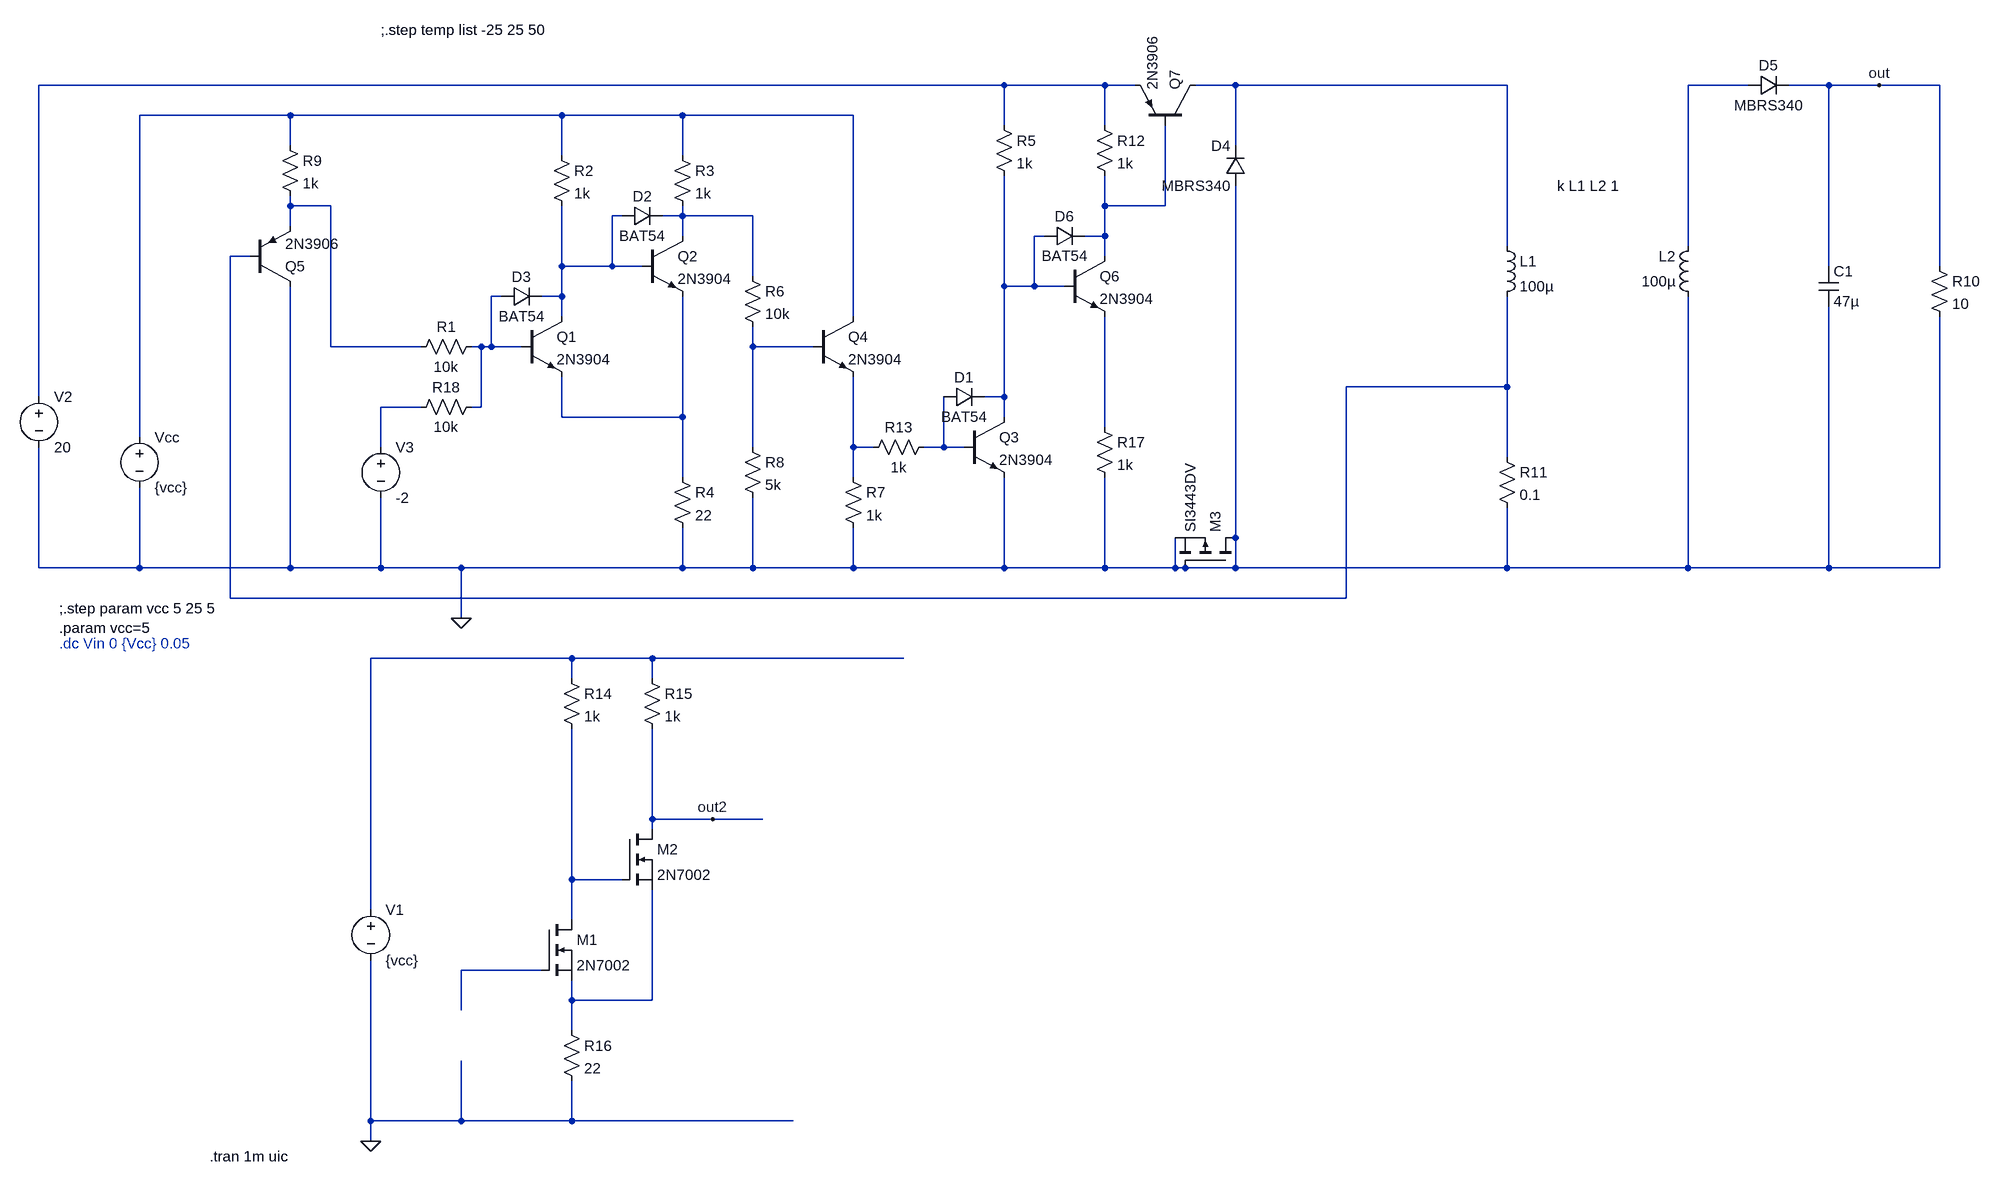
[diagram p0: schematic current_regulator2.asc]
current_regulator2.asc, the LTspice schematic file:
Version 4.1
SHEET 1 3940 3804
WIRE 912 -288 -624 -288
WIRE 1072 -288 912 -288
WIRE 1120 -288 1072 -288
WIRE 1280 -288 1216 -288
WIRE 1712 -288 1280 -288
WIRE 2096 -288 2000 -288
WIRE 2224 -288 2160 -288
WIRE 2304 -288 2224 -288
WIRE 2400 -288 2304 -288
WIRE -224 -240 -464 -240
WIRE 208 -240 -224 -240
WIRE 400 -240 208 -240
WIRE 672 -240 400 -240
WIRE 912 -224 912 -288
WIRE 1072 -224 1072 -288
WIRE -224 -192 -224 -240
WIRE 1280 -192 1280 -288
WIRE 208 -176 208 -240
WIRE 400 -176 400 -240
WIRE -224 -96 -224 -112
WIRE -160 -96 -224 -96
WIRE 1072 -96 1072 -144
WIRE 1168 -96 1168 -224
WIRE 1168 -96 1072 -96
WIRE 304 -80 288 -80
WIRE 400 -80 400 -96
WIRE 400 -80 368 -80
WIRE 512 -80 400 -80
WIRE -224 -64 -224 -96
WIRE 400 -48 400 -80
WIRE 976 -48 960 -48
WIRE 1072 -48 1072 -96
WIRE 1072 -48 1040 -48
WIRE 1712 -32 1712 -288
WIRE 2000 -32 2000 -288
WIRE -288 -16 -320 -16
WIRE 1072 -16 1072 -48
WIRE 208 0 208 -96
WIRE 288 0 288 -80
WIRE 288 0 208 0
WIRE 336 0 288 0
WIRE 2224 0 2224 -288
WIRE 2400 0 2400 -288
WIRE 512 16 512 -80
WIRE 912 32 912 -144
WIRE 960 32 960 -48
WIRE 960 32 912 32
WIRE 1008 32 960 32
WIRE 112 48 96 48
WIRE 208 48 208 0
WIRE 208 48 176 48
WIRE 208 80 208 48
WIRE 672 80 672 -240
WIRE -160 128 -160 -96
WIRE -16 128 -160 128
WIRE 80 128 64 128
WIRE 96 128 96 48
WIRE 96 128 80 128
WIRE 144 128 96 128
WIRE 512 128 512 96
WIRE 608 128 512 128
WIRE 1712 192 1712 48
WIRE 1712 192 1456 192
WIRE -624 208 -624 -288
WIRE 912 208 912 32
WIRE 912 208 880 208
WIRE -16 224 -80 224
WIRE 80 224 80 128
WIRE 80 224 64 224
WIRE 208 240 208 176
WIRE 400 240 400 48
WIRE 400 240 208 240
WIRE 912 240 912 208
WIRE 1072 256 1072 80
WIRE -464 272 -464 -240
WIRE -80 288 -80 224
WIRE 512 288 512 128
WIRE 672 288 672 176
WIRE 704 288 672 288
WIRE 816 288 816 208
WIRE 816 288 784 288
WIRE 848 288 816 288
WIRE 1712 304 1712 192
WIRE 400 336 400 240
WIRE 672 336 672 288
WIRE 1280 432 1280 -128
WIRE -624 480 -624 288
WIRE -464 480 -464 352
WIRE -464 480 -624 480
WIRE -224 480 -224 32
WIRE -224 480 -464 480
WIRE -80 480 -80 368
WIRE -80 480 -224 480
WIRE 48 480 -80 480
WIRE 400 480 400 416
WIRE 400 480 48 480
WIRE 512 480 512 368
WIRE 512 480 400 480
WIRE 672 480 672 416
WIRE 672 480 512 480
WIRE 912 480 912 336
WIRE 912 480 672 480
WIRE 1072 480 1072 336
WIRE 1072 480 912 480
WIRE 1184 480 1184 432
WIRE 1184 480 1072 480
WIRE 1200 480 1184 480
WIRE 1280 480 1280 432
WIRE 1280 480 1200 480
WIRE 1712 480 1712 384
WIRE 1712 480 1280 480
WIRE 2000 480 2000 48
WIRE 2000 480 1712 480
WIRE 2224 480 2224 64
WIRE 2224 480 2000 480
WIRE 2400 480 2400 80
WIRE 2400 480 2224 480
WIRE -320 528 -320 -16
WIRE 1456 528 1456 192
WIRE 1456 528 -320 528
WIRE 48 560 48 480
WIRE 224 624 -96 624
WIRE 352 624 224 624
WIRE 752 624 352 624
WIRE 224 656 224 624
WIRE 352 656 352 624
WIRE 352 880 352 736
WIRE 448 880 352 880
WIRE 528 880 448 880
WIRE 352 896 352 880
WIRE 224 976 224 736
WIRE 304 976 224 976
WIRE -96 1024 -96 624
WIRE 224 1040 224 976
WIRE 176 1120 48 1120
WIRE 224 1168 224 1136
WIRE 352 1168 352 992
WIRE 352 1168 224 1168
WIRE 48 1184 48 1120
WIRE 224 1216 224 1168
WIRE -96 1360 -96 1104
WIRE 48 1360 48 1264
WIRE 48 1360 -96 1360
WIRE 224 1360 224 1296
WIRE 224 1360 48 1360
WIRE 576 1360 224 1360
WIRE -96 1392 -96 1360
FLAG 48 560 0
FLAG -96 1392 0
FLAG 448 880 out2
FLAG 2304 -288 out
SYMBOL npn 144 80 R0
SYMATTR InstName Q1
SYMATTR Value 2N3904
SYMBOL npn 336 -48 R0
SYMATTR InstName Q2
SYMATTR Value 2N3904
SYMBOL voltage -464 256 R0
SYMATTR InstName Vcc
SYMATTR Value {vcc}
SYMBOL res 192 -192 R0
SYMATTR InstName R2
SYMATTR Value 1k
SYMBOL res 384 -192 R0
SYMATTR InstName R3
SYMATTR Value 1k
SYMBOL res 384 320 R0
SYMATTR InstName R4
SYMATTR Value 22
SYMBOL res 80 112 R90
WINDOW 0 0 56 VBottom 2
WINDOW 3 32 56 VTop 2
SYMATTR InstName R1
SYMATTR Value 10k
SYMBOL nmos 176 1040 R0
SYMATTR InstName M1
SYMATTR Value 2N7002
SYMBOL nmos 304 896 R0
SYMATTR InstName M2
SYMATTR Value 2N7002
SYMBOL res 208 640 R0
SYMATTR InstName R14
SYMATTR Value 1k
SYMBOL res 336 640 R0
SYMATTR InstName R15
SYMATTR Value 1k
SYMBOL res 208 1200 R0
SYMATTR InstName R16
SYMATTR Value 22
SYMBOL voltage -96 1008 R0
SYMATTR InstName V1
SYMATTR Value {vcc}
SYMBOL voltage -624 192 R0
SYMATTR InstName V2
SYMATTR Value 20
SYMBOL npn 848 240 R0
SYMATTR InstName Q3
SYMATTR Value 2N3904
SYMBOL res 896 -240 R0
SYMATTR InstName R5
SYMATTR Value 1k
SYMBOL res 656 320 R0
SYMATTR InstName R7
SYMATTR Value 1k
SYMBOL diode 816 224 R270
WINDOW 0 32 32 VTop 2
WINDOW 3 0 32 VBottom 2
SYMATTR InstName D1
SYMATTR Value BAT54
SYMBOL npn 608 80 R0
SYMATTR InstName Q4
SYMATTR Value 2N3904
SYMBOL res 496 0 R0
SYMATTR InstName R6
SYMATTR Value 10k
SYMBOL res 496 272 R0
SYMATTR InstName R8
SYMATTR Value 5k
SYMBOL diode 304 -64 R270
WINDOW 0 32 32 VTop 2
WINDOW 3 0 32 VBottom 2
SYMATTR InstName D2
SYMATTR Value BAT54
SYMBOL diode 112 64 R270
WINDOW 0 32 32 VTop 2
WINDOW 3 0 32 VBottom 2
SYMATTR InstName D3
SYMATTR Value BAT54
SYMBOL res -240 -208 R0
SYMATTR InstName R9
SYMATTR Value 1k
SYMBOL pnp -288 32 M180
SYMATTR InstName Q5
SYMATTR Value 2N3906
SYMBOL pmos 1280 480 M270
SYMATTR InstName M3
SYMATTR Value SI3443DV
SYMBOL ind 1696 -48 R0
SYMATTR InstName L1
SYMATTR Value 100µ
SYMATTR Type ind
SYMATTR SpiceLine Rser=1m
SYMBOL cap 2208 0 R0
SYMATTR InstName C1
SYMATTR Value 47µ
SYMBOL res 2384 -16 R0
SYMATTR InstName R10
SYMATTR Value 10
SYMBOL res 1696 288 R0
SYMATTR InstName R11
SYMATTR Value 0.1
SYMBOL diode 1296 -128 R180
WINDOW 0 24 64 Left 2
WINDOW 3 24 0 Left 2
SYMATTR InstName D4
SYMATTR Value MBRS340
SYMBOL ind 2016 64 R180
WINDOW 0 36 80 Left 2
WINDOW 3 36 40 Left 2
SYMATTR InstName L2
SYMATTR Value 100µ
SYMATTR Type ind
SYMATTR SpiceLine Rser=1m
SYMBOL diode 2096 -272 R270
WINDOW 0 32 32 VTop 2
WINDOW 3 0 32 VBottom 2
SYMATTR InstName D5
SYMATTR Value MBRS340
SYMBOL npn 1008 -16 R0
SYMATTR InstName Q6
SYMATTR Value 2N3904
SYMBOL res 1056 -240 R0
SYMATTR InstName R12
SYMATTR Value 1k
SYMBOL diode 976 -32 R270
WINDOW 0 32 32 VTop 2
WINDOW 3 0 32 VBottom 2
SYMATTR InstName D6
SYMATTR Value BAT54
SYMBOL res 800 272 R90
WINDOW 0 0 56 VBottom 2
WINDOW 3 32 56 VTop 2
SYMATTR InstName R13
SYMATTR Value 1k
SYMBOL res 1056 240 R0
SYMATTR InstName R17
SYMATTR Value 1k
SYMBOL pnp 1216 -224 M270
SYMATTR InstName Q7
SYMATTR Value 2N3906
SYMBOL voltage -80 272 R0
SYMATTR InstName V3
SYMATTR Value -2
SYMBOL res 80 208 R90
WINDOW 0 0 56 VBottom 2
WINDOW 3 32 56 VTop 2
SYMATTR InstName R18
SYMATTR Value 10k
TEXT -592 600 Left 2 ;.dc Vin 0 {Vcc} 0.05
TEXT -592 544 Left 2 !;.step param vcc 5 25 5\n.param vcc=5
TEXT -80 -376 Left 2 !;.step temp list -25 25 50
TEXT -352 1416 Left 2 !.tran 1m uic
TEXT 1792 -128 Left 2 !k L1 L2 1

The netlist it stands for:
* current_regulator2.asc
Q1 N007 N011 N014 0 2N3904
Q2 N008 N007 N014 0 2N3904
Vcc N004 0 {vcc}
R2 N004 N007 1k
R3 N004 N008 1k
R4 N014 0 22
R1 N011 N005 10k
M1 N019 N020 N021 N021 2N7002
M2 out2 N019 N021 N021 2N7002
R14 N018 N019 1k
R15 N018 out2 1k
R16 N021 0 22
V1 N018 0 {vcc}
V2 N001 0 20
Q3 N009 N017 0 0 2N3904
R5 N001 N009 1k
R7 N016 0 1k
D1 N017 N009 BAT54
Q4 N004 N012 N016 0 2N3904
R6 N008 N012 10k
R8 N012 0 5k
D2 N007 N008 BAT54
D3 N011 N007 BAT54
R9 N004 N005 1k
Q5 0 N010 N005 0 2N3906
M3 0 0 0 0 SI3443DV
L1 N002 N010 100µ Rser=1m
C1 out 0 47µ
R10 out 0 10
R11 N010 0 0.1
D4 0 N002 MBRS340
L2 0 N003 100µ Rser=1m
D5 N003 out MBRS340
Q6 N006 N009 N015 0 2N3904
R12 N001 N006 1k
D6 N009 N006 BAT54
R13 N017 N016 1k
R17 N015 0 1k
Q7 N002 N006 N001 0 2N3906
V3 N013 0 -2
R18 N011 N013 10k
.model D D
.lib standard.dio
.model NPN NPN
.model PNP PNP
.lib standard.bjt
.model NMOS NMOS
.model PMOS PMOS
.lib standard.mos
* .dc Vin 0 {Vcc} 0.05
;.step param vcc 5 25 5
.param vcc=5
;.step temp list -25 25 50
.tran 1m uic
k L1 L2 1
.backanno
.end